# EAGLE design control_rev_101 (EAGLE 6.3)
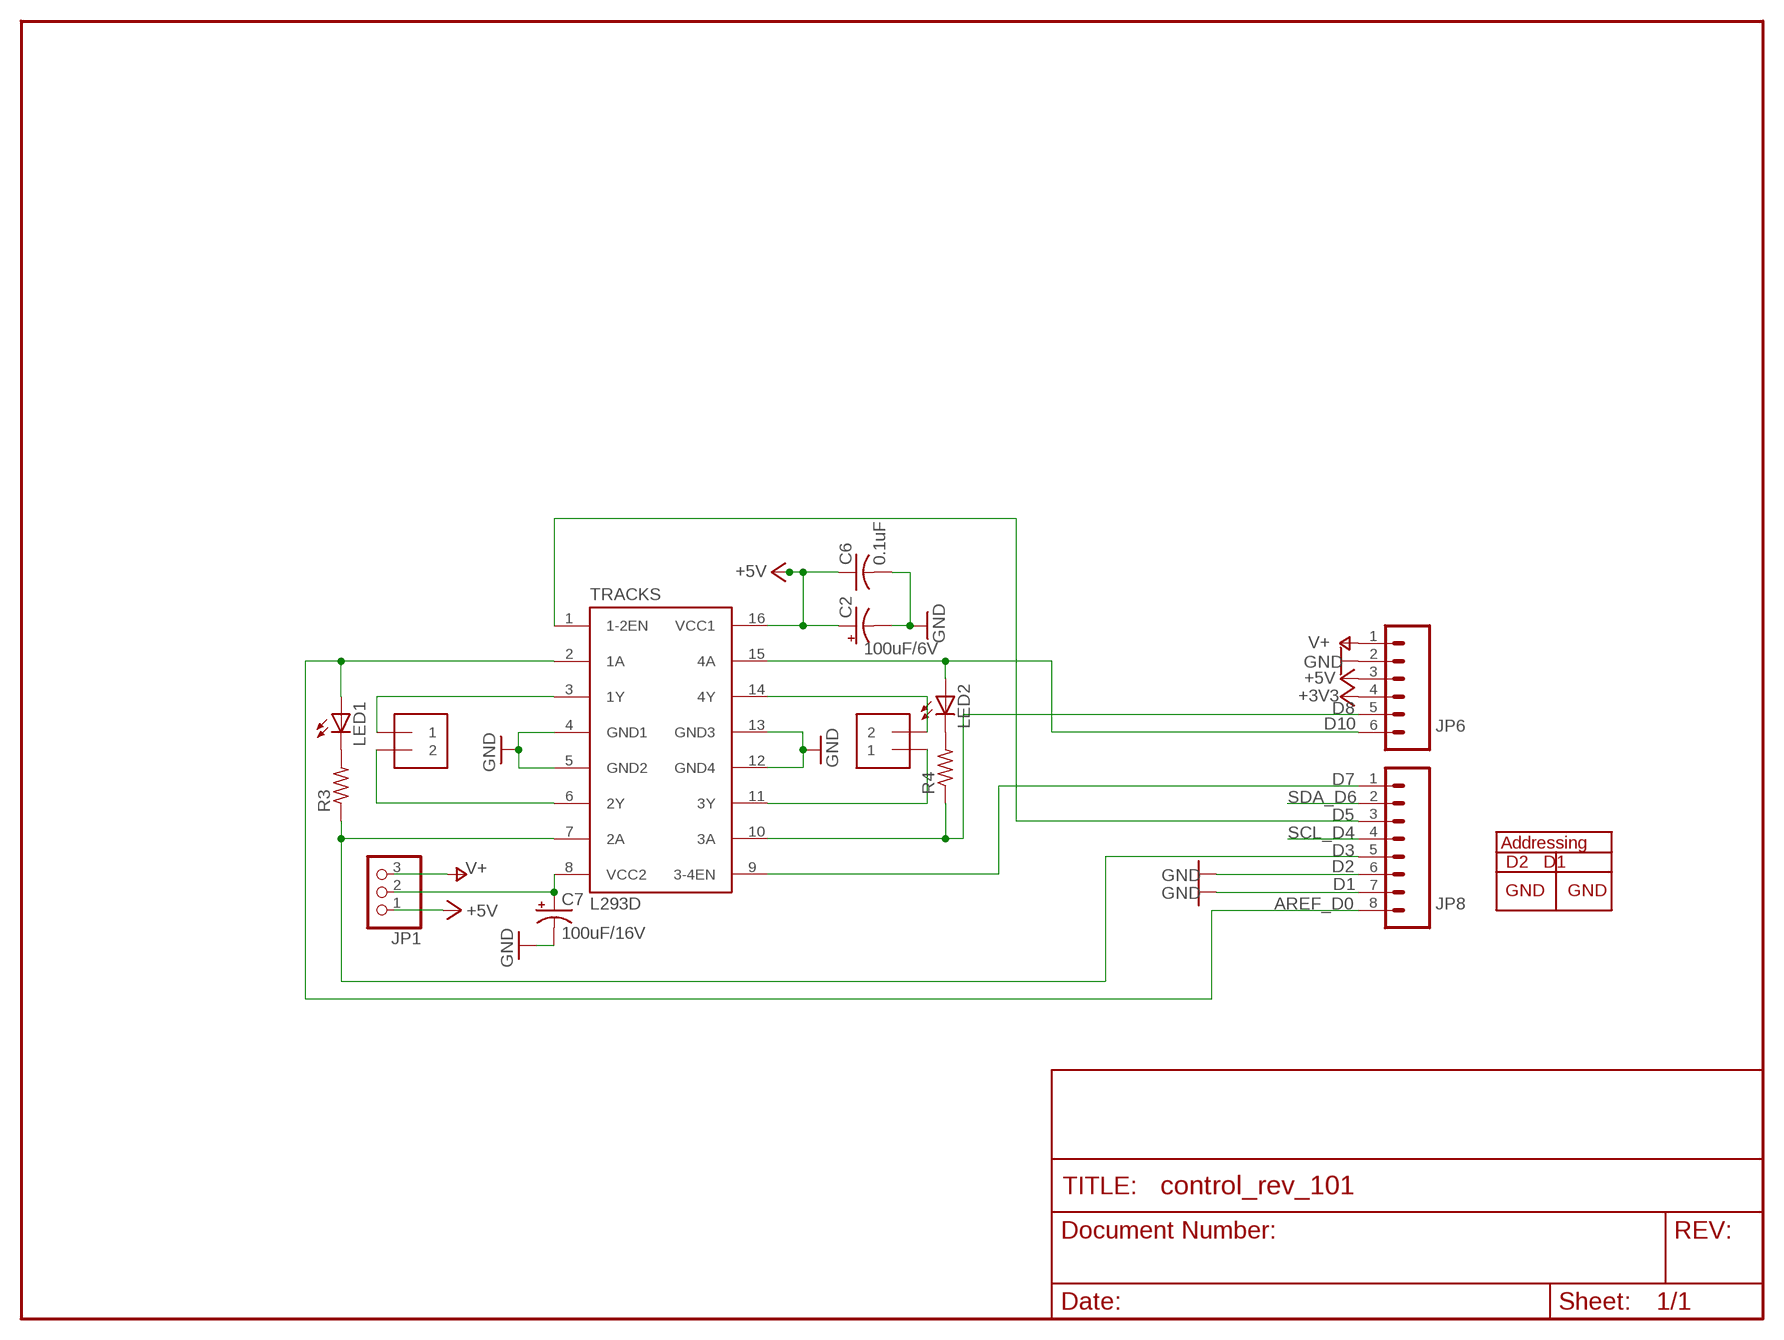
[diagram p0: schematic, sheet 1]

## Parts
C2  100uF/6V  CPOL-USE2.5-5  [E2,5-5]
C6  0.1uF  C-US025-025X050  [C025-025X050]
C7  100uF/16V  CPOL-USE2.5-6  [E2,5-6]
J1  1X2-3.5MM  [1X2-3.5MM]
J2  1X2-3.5MM  [1X2-3.5MM]
JP1  PINHD-1X3  [1X03]
JP6  M06SIP  [1X06]
JP8  M081X08  [1X08]
LED1  LED3MM  [LED3MM]
LED2  LED3MM  [LED3MM]
R3  R-US_0204/2V  [0204V]
R4  R-US_0204/2V  [0204V]
TRACKS  L293D  L293E  [DIL16]

## Nets
+3V3: JP6.4
+5V: C2.+ C6.1 JP1.1 JP6.3 TRACKS.16(VCC1)
AREF_D0: JP8.8 LED1.A TRACKS.2(1A)
D1: JP8.7 ; supply symbol labelled GND
D2: JP8.6 ; supply symbol labelled GND
D3: JP8.5 R3.1 TRACKS.7(2A)
D5: JP8.3 TRACKS.1(1-2EN)
D7: JP8.1 TRACKS.9(3-4EN)
D8: JP6.5 R4.1 TRACKS.10(3A)
D10: JP6.6 LED2.A TRACKS.15(4A)
GND: C2.- C6.2 C7.- JP6.2 TRACKS.4(GND1) TRACKS.5(GND2) TRACKS.12(GND4) TRACKS.13(GND3)
N$1: J1.1 TRACKS.3(1Y)
N$2: J2.2 TRACKS.14(4Y)
N$3: J1.2 TRACKS.6(2Y)
N$4: J2.1 TRACKS.11(3Y)
N$6: LED1.K(C) R3.2
N$7: LED2.K(C) R4.2
N$8: C7.+ JP1.2 TRACKS.8(VCC2)
SCL_D4: JP8.4
SDA_D6: JP8.2
V+: JP1.3 JP6.1

## Library data of the parts
C2 C7 = rcl-ez:CPOL-US: POLARIZED CAPACITOR, American symbol
C6 = rcl-ez:C-US: CAPACITOR, American symbol
J1 J2 = adafruit_mod:1X2: 3.5mm Terminal block http://www.ladyada.net/library/pcb/eaglelibrary.html
JP1 = adafruit_mod:PINHD-1X3: PIN HEADER
JP6 = SparkFun:M06: Header 6 Standard 6-pin 0.1" header. Use with straight break away headers (SKU : PRT-00116), right angle break away headers (PRT-00553), swiss pins (PRT-00743), machine pins (PRT-00117), and female headers (PRT-00115). Molex polarized connector foot print use with SKU : PRT-08094 with associated crimp pins and housings. NOTES ON THE VARIANTS LOCK and LOCK_LONGPADS... This footprint was designed to help hold the alignment of a through-hole component (i.e. 6-pin header) while soldering it into place. You may notice that each hole has been shifted either up or down by 0.005 of an inch from it's more standard position (which is a perfectly straight line). This slight alteration caused the pins (the squares in the middle) to touch the edges of the holes. Because they are alternating, it causes a "brace" to hold the component in place. 0.005 has proven to be the perfect amount of "off-center" position when using our standard breakaway headers. Although looks a little odd when you look at the bare footprint, once you have a header in there, the alteration is very hard to notice. Also, if you push a header all the way into place, it is covered up entirely on the bottom side. This idea of altering the position of holes to aid alignment will be further integrated into the Sparkfun Library for other footprints. It can help hold any component with 3 or more connection pins.
JP8 = SparkFun:M08: Header 8 Standard 8-pin 0.1" header. Use with straight break away headers (SKU : PRT-00116), right angle break away headers (PRT-00553), swiss pins (PRT-00743), machine pins (PRT-00117), and female headers (PRT-00115).
LED1 LED2 = adafruit:LED: LED OSRAM: - CHIPLED LG R971, LG N971, LY N971, LG Q971, LY Q971, LO R971, LY R971 LH N974, LH R974 LS Q976, LO Q976, LY Q976 LO Q996 - Hyper CHIPLED LW Q18S LB Q993, LB Q99A, LB R99A - SideLED LS A670, LO A670, LY A670, LG A670, LP A670 LB A673, LV A673, LT A673, LW A673 LH A674 LY A675 LS A676, LA A676, LO A676, LY A676, LW A676 LS A679, LY A679, LG A679 - Hyper Micro SIDELED® LS Y876, LA Y876, LO Y876, LY Y876 LT Y87S - SmartLED LW L88C, LW L88S LB L89C, LB L89S, LG L890 LS L89K, LO L89K, LY L89K LS L896, LA L896, LO L896, LY L896 - TOPLED LS T670, LO T670, LY T670, LG T670, LP T670 LSG T670, LSP T670, LSY T670, LOP T670, LYG T670 LG T671, LOG T671, LSG T671 LB T673, LV T673, LT T673, LW T673 LH T674 LS T676, LA T676, LO T676, LY T676, LB T676, LH T676, LSB T676, LW T676 LB T67C, LV T67C, LT T67C, LS T67K, LO T67K, LY T67K, LW E67C LS E67B, LA E67B, LO E67B, LY E67B, LB E67C, LV E67C, LT E67C LW T67C LS T679, LY T679, LG T679 LS T770, LO T770, LY T770, LG T770, LP T770 LB T773, LV T773, LT T773, LW T773 LH T774 LS E675, LA E675, LY E675, LS T675 LS T776, LA T776, LO T776, LY T776, LB T776 LHGB T686 LT T68C, LB T68C - Hyper Mini TOPLED® LB M676 - Mini TOPLED Santana® LG M470 LS M47K, LO M47K, LY M47K Source: http://www.osram.convergy.de/
R3 R4 = adafruit_mod:R-US_: RESISTOR, American symbol
TRACKS = texas:L293E: TI DEVICE

## Net classes
1 power: width 0.61 mm

## Board
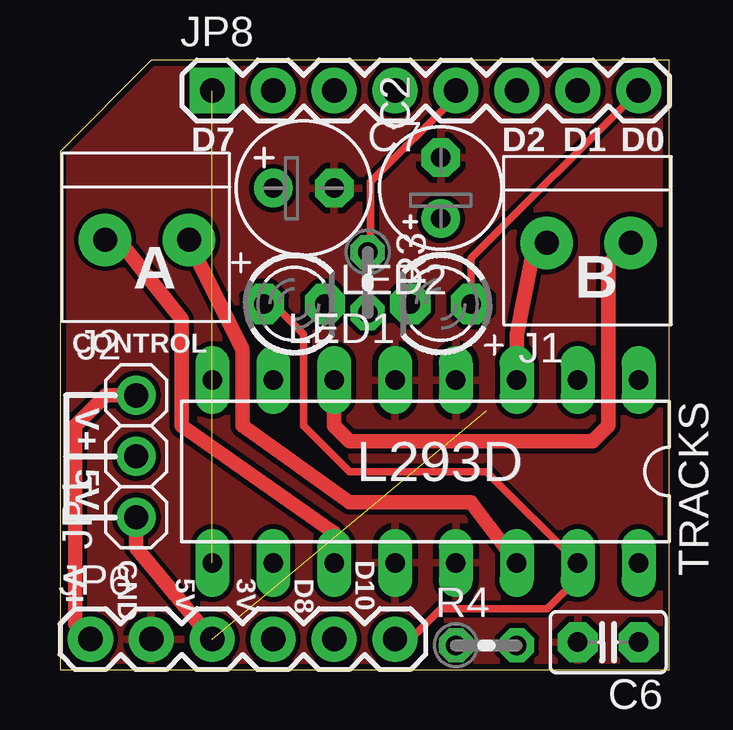
[diagram p1: board, top side]
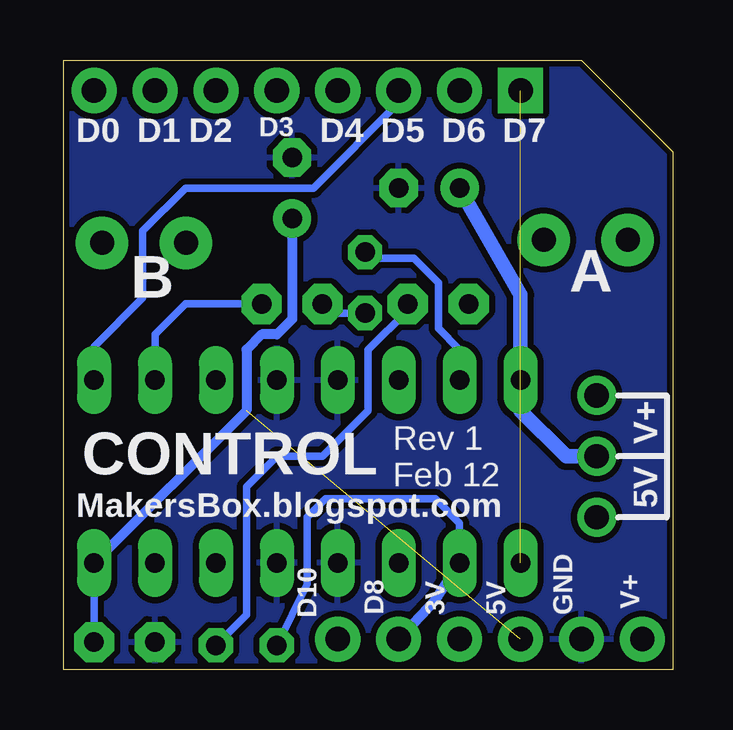
[diagram p2: board, bottom side, seen from below]

Size 25.4 x 25.4 mm. Coordinates in mm from the lower left corner, seen from the top.
Outline: 25.4,25.4 25.4,21.59 25.4,0 24.77,0 24.77,0 0,0 0,21.59
Outline: 25.4,25.4 3.81,25.4 0,21.59
Outline: 0,21.59 0,21.59
Copper layers (1*16): Top 0.035mm / dielectric 1.5mm / Bottom 0.035mm
Design rules "SparkFun": minimum track width 8mil, minimum drill 20mil, track to track 8mil, track to pad 8mil, pad to pad 8mil, via to via 8mil, smd to smd 8mil, copper to edge 10mil, drill to drill 8mil, minimum pad ring 12mil, minimum via ring 10mil, stop-mask expansion 4mil, vias tented up to drill 25mil, thermal gap 10mil

### Footprints (pad centres in the part's own frame; a part is rotated, then mirrored left to right if it is on the bottom)
E2,5-5 = drill 0.813 pad 1.6: + -1.27,0 | drill 0.813 pad 1.6 octagon: - 1.27,0
C025-025X050 = drill 0.813 pad 1.676 octagon: 1 -1.27,0; 2 1.27,0
E2,5-6 = drill 0.813 pad 1.6: + -1.27,0 | drill 0.813 pad 1.6 octagon: - 1.27,0
1X2-3.5MM = drill 1 pad 2.184: 1 1.8,0; 2 -1.7,0
1X03 = drill 1.016: 1 -2.54,0; 2 0,0; 3 2.54,0
1X06 = drill 1.016 pad 1.88: 1 0,0; 2 2.54,0; 3 5.08,0; 4 7.62,0; 5 10.16,0; 6 12.7,0
1X08 = drill 1.016 pad 1.88 square: 1 0,0 | drill 1.016 pad 1.88: 2 2.54,0; 3 5.08,0; 4 7.62,0; 5 10.16,0; 6 12.7,0; 7 15.24,0; 8 17.78,0
LED3MM = drill 0.813 pad 1.676 octagon: A -1.27,0; K 1.27,0
0204V = drill 0.813 octagon: 1 -1.27,0; 2 1.27,0
DIL16 = drill 0.813 long: 1 -8.89,-3.81; 2 -6.35,-3.81; 3 -3.81,-3.81; 4 -1.27,-3.81; 5 1.27,-3.81; 6 3.81,-3.81; 7 6.35,-3.81; 8 8.89,-3.81; 9 8.89,3.81; 10 6.35,3.81; 11 3.81,3.81; 12 1.27,3.81; 13 -1.27,3.81; 14 -3.81,3.81; 15 -6.35,3.81; 16 -8.89,3.81

### Placement (x,y rotation side)
C2  15.88,20.07 90 top
C6  22.86,1.14 180 top
C7  10.16,20.07 0 top
J1  22.1,17.78 180 top
J2  3.68,17.91 180 top
JP1  3.17,8.89 90 top
JP6  1.27,1.27 0 top
JP8  6.35,24.13 0 top
LED1  15.88,15.24 180 top
LED2  9.78,15.24 0 top
R3  12.83,16.13 270 top
R4  17.78,1.02 0 top
TRACKS  15.24,8.26 180 top

### Tracks (layer width: path | path; a pad name or v marks a point on that pad's centre or on a via)
+5V  (1 unrouted)
  Top 0.61: JP6.3 3.17,5.08 JP1.1
  Bottom 0.305: C6.1 TRACKS.16
  Bottom 0.406: C2.+ 15.88,14.61 16.51,13.97 17.14,13.97 17.78,13.34 17.78,10.79 TRACKS.16
AREF_D0
  Top 0.305: LED1.A 17.14,17.14 JP8.8
  Bottom 0.305: TRACKS.2 21.59,13.97 20.32,15.24 LED1.A
D3
  Top 0.305: JP8.5 16.51,23.88 12.95,20.32 12.95,17.53 R3.1
  Bottom 0.305: TRACKS.7 8.89,13.34 9.78,14.22 9.78,16.13 10.79,17.14 12.57,17.14 R3.1
D5
  Bottom 0.305: TRACKS.1 24.13,13.46 22.1,15.49 22.1,18.29 20.32,20.07 14.99,20.07 11.43,23.62 JP8.3
D7  (1 unrouted)
D8
  Bottom 0.305: R4.1 15.24,3.56 15.24,6.35 14.48,7.11 9.91,7.11 8.89,6.1 TRACKS.10
  Bottom 0.406: JP6.5 9.91,2.92 TRACKS.10
D10
  Top 0.305: JP6.6 14.61,1.27 15.88,2.54 20.32,2.54 21.59,3.81 TRACKS.15 17.78,8.26 12.06,8.26 10.16,10.16 10.16,13.97 8.89,15.24 LED2.A
GND
  pour Bottom (isolate 0.254): -1.27,26.67 26.67,26.67 26.67,-1.27 -1.27,-1.27
  pour Top: -0.64,26.04 26.67,26.04 26.67,0 26.04,-0.64 -0.64,-0.64
N$1
  Top 0.61: TRACKS.3 19.05,13.97 19.68,17.14 19.68,17.68 J1.1
N$2
  Top 0.61: TRACKS.14 17.14,6.99 12.06,6.99 7.62,10.16 7.62,13.34 5.71,17.14 5.71,17.57 J2.2
N$3
  Top 0.61: TRACKS.6 11.43,10.16 12.06,9.53 22.23,9.53 22.86,10.16 22.86,16.94 J1.2
N$4
  Top 0.61: TRACKS.11 11.43,5.71 5.08,10.16 5.08,14.61 2.54,17.78 J2.1
N$6
  Bottom 0.305: R3.2 14.22,14.86 LED1.K
N$7
  Bottom 0.305: LED2.K 11.05,14.99 12.7,13.34 12.7,10.79 14.61,8.89 16.51,8.89 17.78,7.62 17.78,2.29 R4.2
N$8
  Bottom 0.61: C7.+ 6.35,15.62 TRACKS.8 6.35,10.79 4.45,8.89 JP1.2
V+
  Top 0.61: JP1.3 1.91,11.43 0.64,10.16 0.64,1.91 JP6.1

### Text on the board
tPlace: D7 | D2 | D1 | D0 | A | B | CONTROL | V+ | L293D | 5V | GND | D10 | V+ | 5V | 3V | D8
bPlace: D7 | D6 | D5 | D4 | D3 | D2 | D1 | D0 | A | B | V+ | Rev 1 / Feb 12 | CONTROL | 5V | MakersBox.blogspot.com | V+ | GND | 5V | 3V | D8 | D10